# EasyEDA Pro project ProProject_基于CW32单片机的无刷电机控制器（旋转变压器位置反馈）_2024-06-02.epro, board PCB6
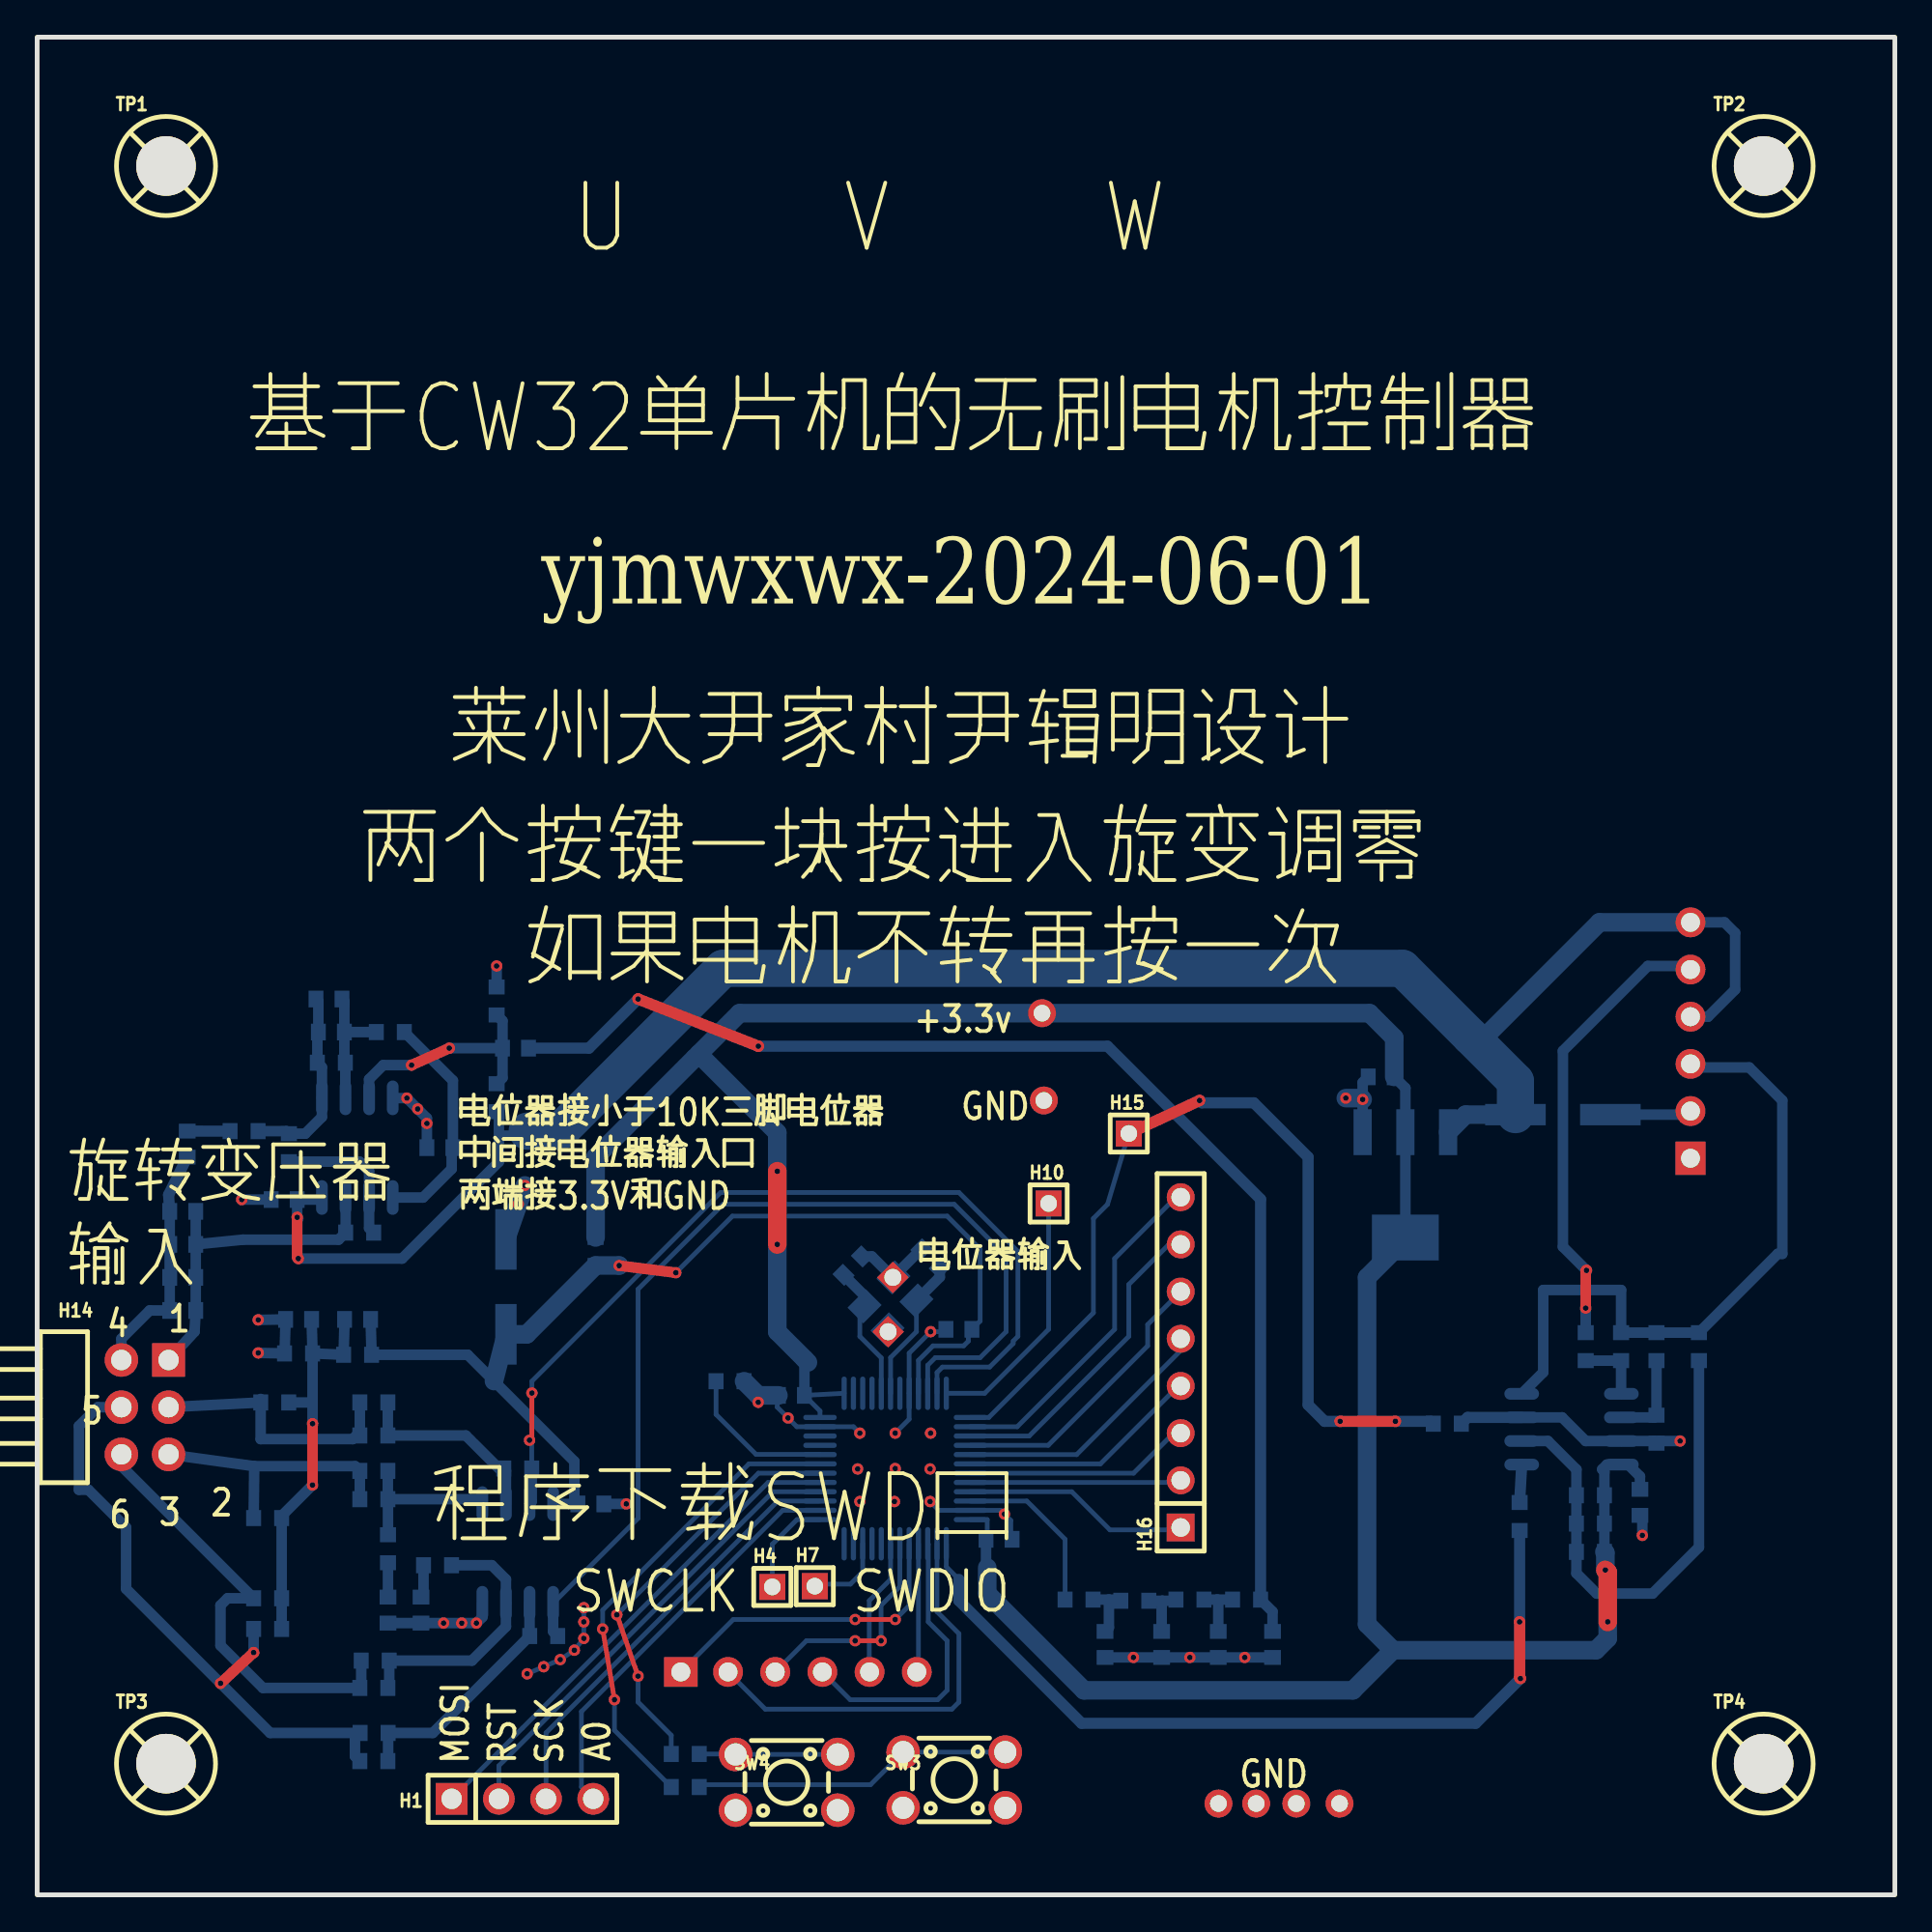
[diagram p4: board, top side]
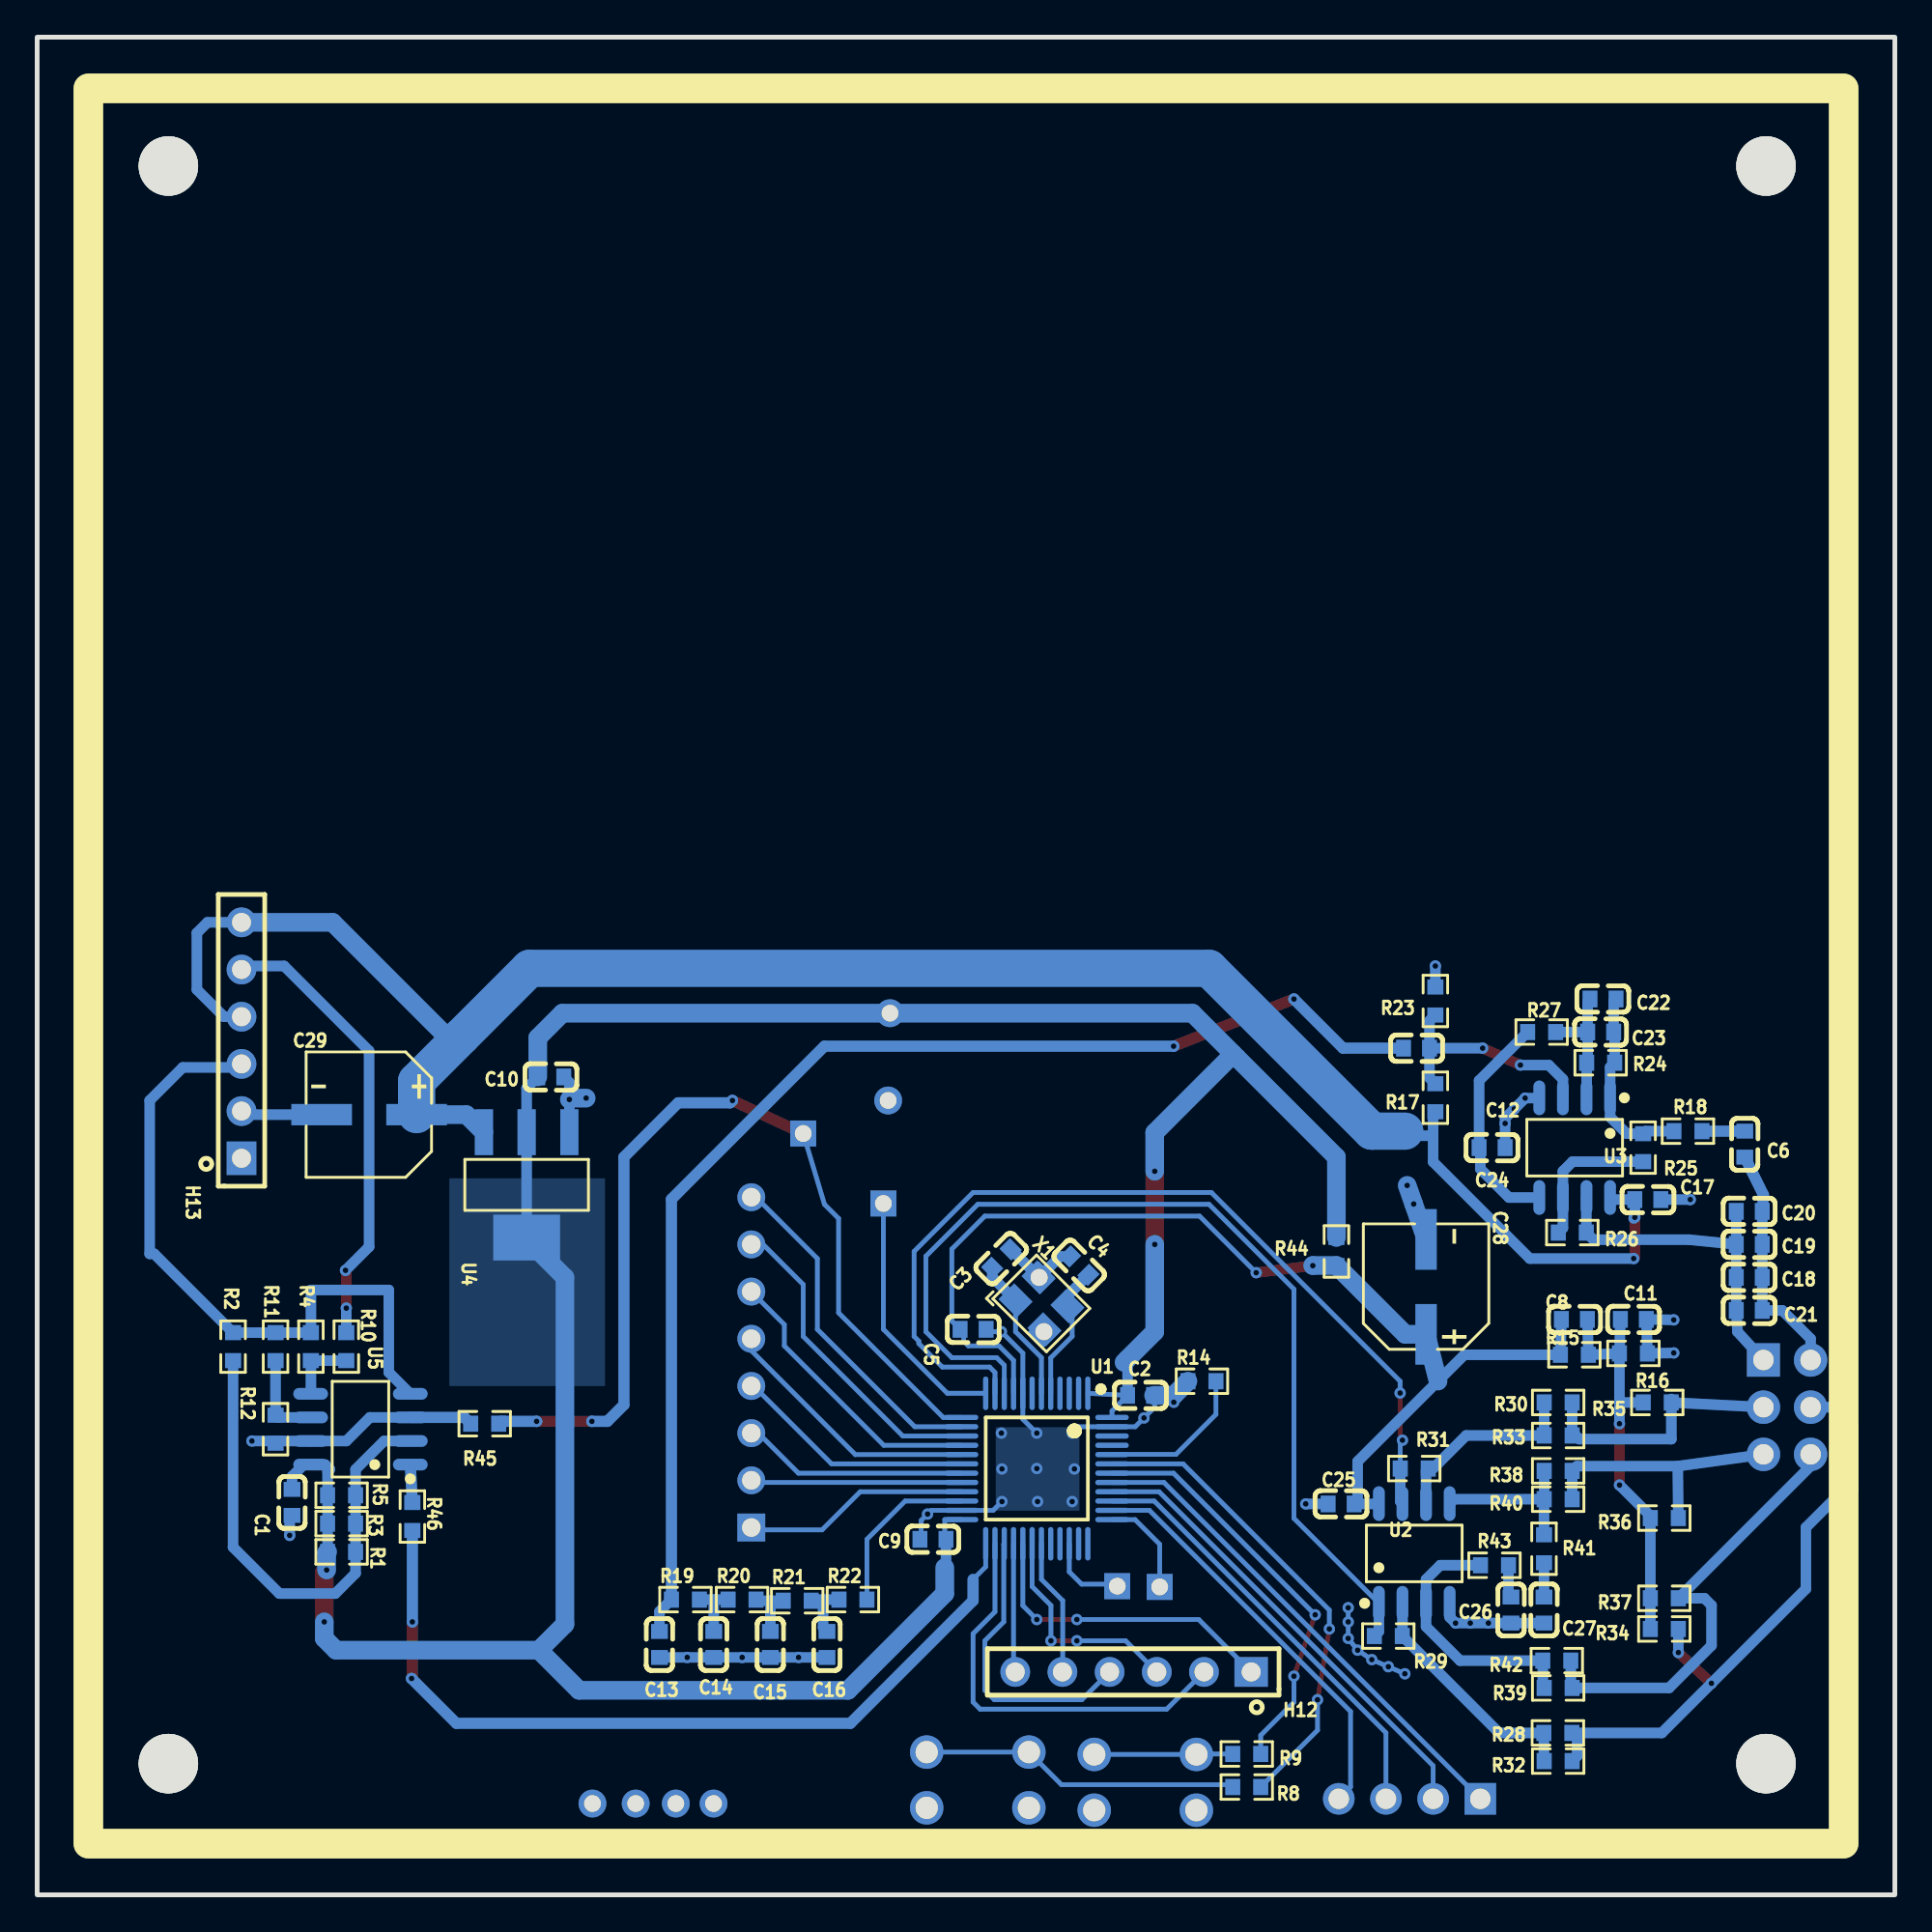
[diagram p5: board, bottom side, seen from below]

Outline 100 x 100 mm; copper layers: Top Layer, Bottom Layer. Coordinates in mm from the lower left corner of the outline.
Outline path: rectangle 0,100 100,0
Stack: Top Layer 0.035mm / Dielectric1 1.51mm FR4 er 4.5 / Bottom Layer 0.035mm

## Design rules (mm)
template: 自定义配置
spacing copperThickness1oz (default): track to track 0.102, other pairs 0.152 to 0.3
spacing copperThickness2oz: track to track 0.203, other pairs 0.152 to 0.3
track width copperThickness1oz (default): min 0.127, default 0.254, max 2.54
track width copperThickness2oz: min 0.203, default 0.254, max 2.54
differential pair differentialPair (default): width min 0.127, default 0.254, max 2.54; gap min 0.152, default 0.152
via viaSize (default): diameter min 0.5, default 0.61, max 10; hole min 0.3, default 0.305, max 6.3

## Placement (name value [footprint] x y rotation side)
C1  10uF  [C0603]  86.28 21.13 90 bottom
C2  10uF  [C0603]  40.6 26.89 180 bottom
C3  10pF  [C0603]  48.09 34.25 135 bottom
C4  10pF  [C0603]  43.9 33.87 225 bottom
C5  10uF  [C0603]  49.62 30.44 0 bottom
C6  100nF  [C0603]  8.08 40.41 90 bottom
C8  10uF  [C0603]  17.25 30.98 0 bottom
C9  10uF  [C0603]  51.78 19.14 180 bottom
C10  10uF  [C0603]  72.35 44.03 0 bottom
C11  10uF  [C0603]  14.07 30.98 0 bottom
C12  100nF  [C0603]  25.75 45.58 0 bottom
C13  100pF  [C0603]  66.5 13.48 90 bottom
C14  100pF  [C0603]  63.58 13.48 90 bottom
C15  100pF  [C0603]  60.53 13.48 90 bottom
C16  100pF  [C0603]  57.48 13.48 90 bottom
C17  10uF  [C0603]  13.3 37.43 0 bottom
C18  10nF  [C0603]  7.84 33.24 180 bottom
C19  10nF  [C0603]  7.84 35.01 180 bottom
C20  10nF  [C0603]  7.84 36.79 180 bottom
C21  10nF  [C0603]  7.84 31.46 180 bottom
C22  100pF  [C0603]  15.71 48.22 180 bottom
C23  100pF  [C0603]  15.84 46.44 180 bottom
C24  10uF  [C0603]  21.68 40.22 180 bottom
C25  10uF  [C0603]  29.81 21.04 180 bottom
C26  10uF  [C0603]  20.66 15.33 270 bottom
C27  10uF  [C0603]  18.89 15.33 270 bottom
C28  220uF  [CAP-SMD_BD6.3-L6.6-W6.6-LS7.2-R-RD]  25.23 32.73 270 bottom
C29  220uF  [CAP-SMD_BD6.3-L6.6-W6.6-LS7.2-R-RD]  82.13 42 180 bottom
H1  -  [HDR-TH_4P-P2.54-V-M]  26.12 5.17 0 top
H4  -  [HDR-TH_1P-V-M_XKB_X4611WV-01I-C28D40]  39.57 16.58 0 top
H7  -  [HDR-TH_1P-V-M_XKB_X4611WV-01I-C28D40]  41.86 16.62 0 top
H10  -  [HDR-TH_1P-V-M_XKB_X4611WV-01I-C28D40]  54.45 37.22 0 top
H12  PM254V-11-06-H85  [HDR-TH_6P-P2.54-V-F]  41 12 0 bottom
H13  PM254V-11-06-H85  [HDR-TH_6P-P2.54-V-F]  89 46 90 bottom
H14  PZ254R-12-6P  [HDR-TH_6P-P2.54-H-M-R2-C3-S2.54]  5.8 26.25 270 top
H15  -  [HDR-TH_1P-V-M_XKB_X4611WV-01I-C28D40]  58.76 40.98 0 top
H16  -  [HDR-TH_8P-P2.54-V-M]  61.56 28.66 90 top
NOREF  -  [Pad_e1511]  63.59 4.91 0 top
NOREF#2  -  [Pad_e524]  46.06 33.24 45 top
NOREF#3  -  [Pad_e1491]  54.09 47.46 0 top
NOREF#4  -  [Pad_e526]  45.81 30.31 45 top
NOREF#5  -  [Pad_e1495]  54.19 42.76 0 top
NOREF#6  -  [Pad_e1512]  65.62 4.91 0 top
NOREF#7  -  [Pad_e1513]  67.78 4.91 0 top
NOREF#8  -  [Pad_e1514]  70.11 4.91 0 top
R1  10kΩ  [R0603]  83.61 18.46 0 bottom
R2  10kΩ  [R0603]  89.45 29.51 270 bottom
R3  10kΩ  [R0603]  83.61 19.99 0 bottom
R4  100kΩ  [R0603]  85.26 29.51 270 bottom
R5  10kΩ  [R0603]  83.61 21.51 0 bottom
R8  10kΩ  [R0603]  34.89 5.8 0 bottom
R9  10kΩ  [R0603]  34.89 7.58 0 bottom
R10  10kΩ  [R0603]  83.36 29.51 270 bottom
R11  10kΩ  [R0603]  87.17 29.51 270 bottom
R12  100kΩ  [R0603]  87.17 25.07 270 bottom
R14  10kΩ  [R0603]  37.3 27.65 180 bottom
R15  1kΩ  [R0603]  17.25 29.07 0 bottom
R16  1kΩ  [R0603]  14.07 29.15 0 bottom
R17  1MΩ  [R0603]  24.73 42.91 270 bottom
R18  10Ω  [R0603]  11.14 41.11 0 bottom
R19  10kΩ  [R0603]  65.1 15.89 180 bottom
R20  10kΩ  [R0603]  62.06 15.89 180 bottom
R21  10kΩ  [R0603]  59.09 15.83 180 bottom
R22  10kΩ  [R0603]  56.09 15.89 180 bottom
R23  1MΩ  [R0603]  24.73 48.12 270 bottom
R24  100kΩ  [R0603]  15.84 44.79 0 bottom
R25  100kΩ  [R0603]  13.55 40.22 270 bottom
R26  100kΩ  [R0603]  17.36 35.65 180 bottom
R27  100kΩ  [R0603]  19.01 46.44 0 bottom
R28  100kΩ  [R0603]  18.14 8.72 0 bottom
R29  100kΩ  [R0603]  27.27 13.93 0 bottom
R30  100kΩ  [R0603]  18.12 26.5 0 bottom
R31  100kΩ  [R0603]  25.87 22.95 0 bottom
R32  100kΩ  [R0603]  18.12 7.2 0 bottom
R33  100kΩ  [R0603]  18.12 24.73 0 bottom
R34  100kΩ  [R0603]  12.41 14.31 180 bottom
R35  100kΩ  [R0603]  12.79 26.5 180 bottom
R36  100kΩ  [R0603]  12.41 20.28 0 bottom
R37  100kΩ  [R0603]  12.41 15.96 0 bottom
R38  100kΩ  [R0603]  18.12 22.82 0 bottom
R39  100kΩ  [R0603]  18.12 11.14 0 bottom
R40  100kΩ  [R0603]  18.12 21.3 0 bottom
R41  100kΩ  [R0603]  18.89 18.63 270 bottom
R42  100kΩ  [R0603]  18.2 12.61 0 bottom
R43  100kΩ  [R0603]  21.55 17.74 180 bottom
R44  10Ω  [R0603]  30.06 34.63 270 bottom
R45  1kΩ  [R0603]  75.91 25.36 0 bottom
R46  1kΩ  [R0603]  79.8 20.37 90 bottom
SW3  TC-1109-C-B  [KEY-TH_4P-L4.5-W4.5-P3.00-LS5.8]  49.37 6.19 180 top
SW4  TC-1109-C-B  [KEY-TH_4P-L4.5-W4.5-P3.00-LS5.8]  40.35 6.06 180 top
TP1  -  [M3螺丝]  7 93 0 top
TP2  -  [M3螺丝]  93 93 0 top
TP3  -  [M3螺丝]  7 7 0 top
TP4  -  [M3螺丝]  93 7 0 top
U1  CW32F030C8T6  [LQFP-48_L7.0-W7.0-P0.50-LS9.0-TL]  46.19 22.95 270 bottom
U2  -  [SOP-8_L4.9-W3.9-P1.27-LS6.0-BL]  25.87 18.38 180 bottom
U3  -  [SOP-8_L4.9-W3.9-P1.27-LS6.0-BL]  17.23 40.22 0 bottom
U4  AMS1117-3.3  [SOT-223-4_L6.5-W3.5-P2.30-LS7.0-BR]  73.65 38.22 90 bottom
U5  LMV358ARZ  [SOP-8_L4.9-W3.9-P1.27-LS6.0-BL]  82.6 25.07 90 bottom
X1  8MHz  [OSC-SMD_4P-L3.2-W2.5-BL]  45.94 31.84 225 bottom

## Footprints (pads in the part's own frame, mm; a bottom-side part is the same pattern mirrored in y, then rotated)
C0603
  rect 0.8x0.9 smd: 1(-0.7,0) 2(0.7,0)
CAP-SMD_BD6.3-L6.6-W6.6-LS7.2-R-RD
  rect 3.26x1.15 smd: 1(2.555,0) 2(-2.555,0)
HDR-TH_1P-V-M_XKB_X4611WV-01I-C28D40
  rect 1.4x1.4 hole 0.9: 1(0,0)
HDR-TH_4P-P2.54-V-M
  rect 1.7x1.7 hole 1.1: 1(-3.81,0)
  round 1.7 hole 1.1: 2(-1.27,0) 3(1.27,0) 4(3.81,0)
HDR-TH_6P-P2.54-H-M-R2-C3-S2.54
  rect 1.8x1.778 hole 1.1: 1(-2.54,1.27)
  round 1.8 hole 1.1: 2(0,1.27) 3(2.54,1.27) 4(-2.54,-1.27) 5(0,-1.27) 6(2.54,-1.27)
HDR-TH_6P-P2.54-V-F
  rect 1.8x1.6 hole 1.02: 1(-6.35,0)
  round 1.6 hole 1.02: 2(-3.81,0) 3(-1.27,0) 4(1.27,0) 5(3.81,0) 6(6.35,0)
HDR-TH_8P-P2.54-V-M
  rect 1.5x1.5 hole 1: 1(-8.89,0)
  round 1.5 hole 1: 2(-6.35,0) 3(-3.81,0) 4(-1.27,0) 5(1.27,0) 6(3.81,0) 7(6.35,0) 8(8.89,0)
KEY-TH_4P-L4.5-W4.5-P3.00-LS5.8
  round 1.8 hole 1.2: 1(-2.75,1.5) 2(2.75,1.5) 3(-2.75,-1.5) 4(2.75,-1.5)
LQFP-48_L7.0-W7.0-P0.50-LS9.0-TL
  oval 1.8x0.28 smd: 1(-4.05,2.75) 2(-4.05,2.25) 3(-4.05,1.75) 4(-4.05,1.25) 5(-4.05,0.75) 6(-4.05,0.25) 7(-4.05,-0.25) 8(-4.05,-0.75) 9(-4.05,-1.25) 10(-4.05,-1.75) 11(-4.05,-2.25) 12(-4.05,-2.75) 25(4.05,-2.75) 26(4.05,-2.25) 27(4.05,-1.75) 28(4.05,-1.25) 29(4.05,-0.75) 30(4.05,-0.25) 31(4.05,0.25) 32(4.05,0.75) 33(4.05,1.25) 34(4.05,1.75) 35(4.05,2.25) 36(4.05,2.75)
  oval 0.28x1.8 smd: 13(-2.75,-4.05) 14(-2.25,-4.05) 15(-1.75,-4.05) 16(-1.25,-4.05) 17(-0.75,-4.05) 18(-0.25,-4.05) 19(0.25,-4.05) 20(0.75,-4.05) 21(1.25,-4.05) 22(1.75,-4.05) 23(2.25,-4.05) 24(2.75,-4.05) 37(2.75,4.05) 38(2.25,4.05) 39(1.75,4.05) 40(1.25,4.05) 41(0.75,4.05) 42(0.25,4.05) 43(-0.25,4.05) 44(-0.75,4.05) 45(-1.25,4.05) 46(-1.75,4.05) 47(-2.25,4.05) 48(-2.75,4.05)
M3螺丝
  round 3.2 hole 3.2: 1(-0.064,0.064)
OSC-SMD_4P-L3.2-W2.5-BL
  rect 1.4x1.2 smd: 1(-1.1,-0.875) 2(1.1,-0.875) 3(1.1,0.875) 4(-1.1,0.875)
Pad_e524
  rect 1.2x1.2 hole 0.914: 1(0,0)
Pad_e526
  rect 1.2x1.2 hole 0.914: 1(0,0)
Pad_e1491
  round 1.5 hole 0.9: 1(0,0)
Pad_e1495
  round 1.5 hole 0.9: 2(0,0)
Pad_e1511
  round 1.5 hole 0.9: 3(0,0)
Pad_e1512
  round 1.5 hole 0.9: 4(0,0)
Pad_e1513
  round 1.5 hole 0.9: 9(0,0)
Pad_e1514
  round 1.5 hole 0.9: 49(0,0)
R0603
  rect 0.806x0.864 smd: 1(-0.753,0) 2(0.753,0)
SOP-8_L4.9-W3.9-P1.27-LS6.0-BL
  oval 0.63x1.865 smd: 1(-1.905,-2.683) 2(-0.635,-2.683) 3(0.635,-2.683) 4(1.905,-2.683) 5(1.905,2.683) 6(0.635,2.683) 7(-0.635,2.683) 8(-1.905,2.683)
SOT-223-4_L6.5-W3.5-P2.30-LS7.0-BR
  rect 2.47x0.98 smd: 1(2.835,-2.3) 2(2.835,0) 3(2.835,2.3)
  rect 2.47x3.6 smd: 4(-2.835,0)

## Nets
As in the schematic, except:
+3.3V: C1.2 C2.1 C9.2 C10.2 NOREF#3.1 R1.2 R3.2 R5.2 R44.1 U1.1 U1.24 U1.48 U4.2 U4.4 U5.8
GND: C1.1 C2.2 C3.2 C4.1 C5.1 C9.1 C10.1 C11.1 C13.1 C14.1 C15.1 C16.1 C17.1 C24.2 C25.1 C26.2 C27.2 C28.2 C29.2 H13.2 NOREF.3 NOREF#2.1 NOREF#4.1 NOREF#5.2 NOREF#6.4 NOREF#7.9 NOREF#8.49 R14.1 R16.1 R23.1 SW3.1 SW3.2 SW4.1 SW4.2 U1.8 U1.23 U1.47 U2.4 U3.4 U4.1 X1.2 X1.4
A: TP1.1 TP2.1
$5N2280: H14.5 R28.1 R32.1 R34.2
$5N2281: H14.6 R37.1 R39.1 R42.1
$5N2284: C18.1 C19.1 C20.1 C21.1 H14.1 R26.2 U3.7
$5N2285: C6.1 C18.2 C19.2 C20.2 C21.2 H14.4
$5N2815: H14.2 R30.1 R33.1 R35.2
$5N2828: H14.3 R36.1 R38.1 R40.1

Pads without a net: TP3 1; TP4 1; U1 7 45 46

## Via types
v1: diameter 0.61, hole 0.305, Top Layer to Bottom Layer, 73 vias

## Routing (per net, layer and track width the routed paths; a pad name or vN(x,y) marks a point on that pad's centre or on a via; arc(x,y) is an arc through that point)
+1.65V: length 22.2
  Top Layer w0.568: v1(14.83,25.36) 14.83,22.06 v1(14.82,22.06)
  Bottom Layer w0.568: C8.1 R15.1 R16.2 ; R16.2 14.83,26.56 ; R16.2 C11.2 ; R35.1 14.78,26.5 14.83,26.56 ; 14.83,26.56 v1(14.83,25.36) ; R34.1 R37.2 R36.2 13.16,20.4 v1(14.82,22.06)
+3.3V: length 164.7
  Top Layer w1: v1(39.84,35.01) v1(39.84,38.95) ; v1(84.54,14.69) 84.54,17.36 v1(84.42,17.49)
  Bottom Layer w0.254: U1.1 C2.1 42.14,26.05 U1.48 ; C9.2 51.14,19.2 51.14,20.2 U1.24
  Bottom Layer w0.568: R1.2 R3.2 R5.2 84.37,22.79 84.25,22.91 84.5,23.16 U5.8 85.64,23.16 86.28,22.53 C1.2 ; C2.1 41.3,28.85 ; 51.14,17.62 51.08,17.68 C9.2 ; C10.2 73.65,43.43 U4.2 U4.4
  Bottom Layer w1: 72.99,13.17 70.83,11.01 56.35,11.01 51.14,16.22 51.14,17.62 ; 72.99,13.17 83.91,13.17 84.54,13.81 v1(84.54,14.69) ; 72.99,13.17 71.59,14.57 71.59,33.24 73.88,35.52 ; R44.1 30.06,39.71 35.42,45.07 35.8,45.07 ; v1(39.84,38.95) 39.84,41.03 35.8,45.07 ; 41.49,28.66 39.84,30.31 v1(39.84,35.01) ; v1(84.42,17.49) 84.42,18.41 R1.2 ; 35.8,45.07 35.61,45.26 37.81,47.46 NOREF#3.1 71.73,47.46 73.05,46.13 C10.2
+3.3VA: length 60.7
  Top Layer w0.568: v1(34.38,33.49) v1(31.33,33.87)
  Bottom Layer w0.254: v1(34.38,33.49) 37.43,36.54 48.98,36.54 50.76,34.76 50.76,30.88 C5.2 50.13,30.25 50.13,29.81 49.87,29.55 48.22,29.55 47.44,28.77 U1.9
  Bottom Layer w0.568: C8.2 R15.2 23.18,29.07 28.92,23.33 28.92,21.23 C25.2 27.79,21.04 U2.8
  Bottom Layer w1: 24.59,27.66 C28.1 26.35,30.17 R44.2 31.32,33.88 v1(31.33,33.87)
+5V: length 110.2
  Top Layer w0.568: v1(14.06,34.25) 14,34.31 v1(14,36.47)
  Bottom Layer w0.568: H13.6 90.83,52.35 91.4,51.78 91.4,48.73 89.94,47.27 H13.4 ; 14.06,36.41 v1(14,36.47) C17.2 15.22,37.43 U3.8 ; 24.85,40.86 24.85,42.04 R17.2 ; 24.85,40.86 26.13,40.86 26.38,41.11 ; 24.85,40.86 24.85,39.46 19.65,34.25 v1(14.06,34.25)
  Bottom Layer w1: H13.6 84.1,52.35 77.97,46.22 77.15,46.22 ; C29.1 76.9,42 U4.3
  Bottom Layer w2: C29.1 79.58,43.79 73.5,49.87 36.92,49.87 28.16,41.11 26.38,41.11
GND: length 70.5
  Bottom Layer w0.254: v1(29.43,15.46) v1(29.43,14.69) v1(29.43,13.81) v1(28.92,13.17) v1(28.16,12.66) v1(27.27,12.28) v1(26.38,11.9) ; v1(46.19,24.85) 46.94,25.6 U1.8 46.94,29.16 v1(48.09,30.31) 48.79,30.31 C5.1 ; v1(48.07,21.17) 48.54,20.7 U1.23 51.87,20.7 52.41,20.16 52.41,19.2 C9.1 ; C2.2 39.84,26.82 39.84,26.25 v1(40.42,25.67) 40.89,25.2 U1.47 43.94,25.2 v1(44.28,24.85)
  Bottom Layer w0.568: v1(11.9,30.95) C11.1 R16.1 v1(11.9,29.17) ; C29.2 88.81,42 H13.2 ; U2.4 23.97,14.95 v1(23.65,14.63) v1(22.85,14.63) v1(21.88,14.63) 18.89,14.63 ; U3.4 19.15,42.89 v1(19.9,42.89) v1(20.48,42.3) 20.98,41.81 C24.2 ; 44.4,34.37 44.93,34.37 NOREF#2.1 47.57,34.75 47.6,34.75 ; U4.1 v1(71.35,42.82) 71.35,43.73 C10.1 ; 30.51,21.04 v1(31.71,21.04) ; v1(86.41,19.35) 86.41,20.3 C1.1 ; 24.73,48.87 v1(24.73,50) ; C17.1 v1(11.01,37.43) ; C13.1 v1(65.01,12.78) C14.1 v1(62.05,12.78) C15.1 v1(59.01,12.78) C16.1
  Bottom Layer w1: R14.1 38.82,26.89 C2.2 ; v1(71.35,42.82) 71.28,42.89 v1(70.45,42.89) ; v1(26.25,38.19) v1(25.9,37.19) C28.2
  vias: v1(20.98,41.53) v1(38.82,26.52) v1(44.17,22.93) v1(44.28,21.17) v1(46.15,21.17) v1(46.19,22.95) v1(48.09,24.85) v1(48.07,22.93) v1(52.07,20.5)
GND_BT-: length 37
  Bottom Layer w0.568: U5.4 81.07,28.13 81.07,32.56 85.26,32.56 R4.1 R11.1 R2.1 93.7,34.51 93.94,34.51 93.94,42.76 92.16,44.54 89.19,44.54 H13.3
PA0_ADC: length 54.1
  Bottom Layer w0.254: U2.1 32.35,20.27 32.35,32.6 36.92,37.17 49.37,37.17 52.16,34.38 52.16,30.31 50.76,28.92 48.35,28.92 47.94,28.51 U1.10
  Bottom Layer w0.568: R29.2 27.78,14.18 U2.1
PA1_ADC1: length 49.4
  Top Layer w0.254: v1(26.63,27.01) 26.63,24.6 v1(26.5,24.47)
  Bottom Layer w0.254: v1(26.63,27.01) 26.63,27.65 36.79,37.81 49.62,37.81 52.79,34.63 52.79,30.06 52.54,29.81 52.54,29.68 51.27,28.41 48.73,28.41 48.44,28.12 U1.11 ; R31.2 26.62,24.35 v1(26.5,24.47)
  Bottom Layer w0.568: 26.5,21.06 26.62,21.18 R31.2
PA2_ADC2: length 13.7
  Bottom Layer w0.254: U1.12 51,27 54.45,30.44 H10.1
PA3_ADC3: length 50.9
  Top Layer w0.6: H15.1 v1(62.57,42.76) ; v1(70.14,25.49) v1(73.11,25.49)
  Bottom Layer w0.254: U1.13 51.23,25.7 56.86,31.33 56.86,36.41 57.62,37.17 H15.1
  Bottom Layer w0.6: R45.1 75.03,25.49 v1(73.11,25.49) ; v1(70.14,25.49) 69.3,25.49 68.41,26.38 68.41,39.71 65.49,42.63 62.7,42.63 v1(62.57,42.76)
PA8_ATIM_CH1A_U_H: length 17.1
  Top Layer w0.254: v1(46.19,14.82) v1(44.03,14.82)
  Bottom Layer w0.254: v1(46.19,14.82) 46.94,15.57 U1.29 ; H12.1 37.47,14.82 v1(44.03,14.82)
PA9_ATIM_CH2A_V_H: length 12
  Top Layer w0.254: v1(45.43,13.68) v1(44.03,13.68)
  Bottom Layer w0.254: H12.3 41.41,13.68 v1(44.03,13.68) ; v1(45.43,13.68) 45.43,15.58 46.44,16.59 U1.30
PA10_ATIM_CH3A_W_H: length 7.4
  Bottom Layer w0.254: U1.31 45.94,16.98 44.79,15.84 44.79,12.02 H12.5
PA13_SWDIO: length 4.4
  Bottom Layer w0.254: U1.34 44.44,17.39 43.78,16.73 41.97,16.73 H7.1
PA14_SWCLK: length 5.4
  Bottom Layer w0.254: U1.37 40.9,20.2 39.57,18.87 H4.1
PA15_SPI1_CS_LCD_A0: length 22.3
  Bottom Layer w0.254: U1.38 40.13,20.7 29.3,9.87 29.3,5.8 H1.4
PB3_SPI1_SCK: length 23.5
  Bottom Layer w0.254: U1.39 39.87,21.2 27.39,8.72 H1.3
PB4_LCD_RST: length 25.2
  Bottom Layer w0.254: H1.2 24.85,6.95 39.61,21.7 U1.40
PB5_SPI1_MOSI: length 26.9
  Bottom Layer w0.254: U1.41 39.34,22.2 H1.1
PB11_GTIM2_CH4: length 9.2
  Bottom Layer w0.254: U1.22 53.27,21.2 55.33,19.14 55.33,15.89
PB12_ATIM_BK: length 45.3
  Top Layer w0.6: v1(79.84,11.65) 79.8,11.69 v1(79.8,14.69)
  Bottom Layer w0.254: U1.25 48.94,17.66 49.62,16.98
  Bottom Layer w0.6: 49.62,16.98 49.62,15.84 56.22,9.23 77.43,9.23 v1(79.84,11.65) ; 79.8,19.61 v1(79.8,14.69)
PB13_ATIM_CH1B_U_L: length 22.4
  Bottom Layer w0.254: H12.2 39.19,10 49.24,10 49.62,10.38 49.62,14.06 48.44,15.24 U1.26
PB14_ATIM_CH2B_V_L: length 15.9
  Bottom Layer w0.254: U1.27 47.97,18.87 47.97,14.69 48.98,13.68 48.98,11.01 48.48,10.5 43.77,10.5 H12.4
PB15_ATIM_CH3B_W_L: length 6.9
  Bottom Layer w0.254: H12.6 47.44,12.09 U1.28
$3N1046: length 7.4
  Bottom Layer w0.254: X1.3 44.28,31.43 44.28,30.06 45.44,28.91 U1.5
  Bottom Layer w0.568: 43.41,33.38 44.54,32.25 X1.3
$3N1253: length 7.9
  Bottom Layer w0.254: U1.6 45.94,28.92 47.33,30.31 X1.1
  Bottom Layer w0.568: X1.1 48.59,33.26 48.59,33.76
$3N1416: length 8.3
  Bottom Layer w0.254: R14.2 36.55,25.86 38.7,23.71 42.13,23.71 U1.44
$3N1882: length 25.8
  Top Layer w0.254: v1(31.08,10.5) v1(30.44,14.31)
  Bottom Layer w0.254: R8.1 31.08,8.86 v1(31.08,10.5) ; v1(30.44,14.31) 30.44,15.33 38.31,23.2 U1.43
$3N1886: length 22.5
  Top Layer w0.254: v1(32.35,11.77) v1(31.2,15.07)
  Bottom Layer w0.254: v1(32.35,11.77) 32.35,10.38 34.13,8.59 R9.1 ; v1(31.2,15.07) 38.83,22.7 U1.42
$3N6202: length 12.2
  Bottom Layer w0.254: H16.1 61.43,19.65 57.75,19.65 55.69,21.7 U1.21
$3N6205: length 11.4
  Bottom Layer w0.254: U1.20 61.44,22.2 H16.2
$3N6208: length 12.2
  Bottom Layer w0.254: U1.19 59.02,22.7 61.18,24.85 H16.3
$3N6214: length 13.1
  Bottom Layer w0.254: U1.18 57.24,23.2 61.43,27.39 H16.4
$3N6221: length 14.3
  Bottom Layer w0.254: H16.5 61.56,29.3 55.96,23.7 U1.17
$3N6224: length 15.4
  Bottom Layer w0.254: U1.16 54.43,24.2 59.78,29.55 59.78,30.7 H16.6
$3N6227: length 17.2
  Bottom Layer w0.254: H16.7 60.92,35.01 58.76,32.86 58.76,30.06 53.4,24.7 U1.15
$3N6233: length 18.7
  Bottom Layer w0.254: U1.14 52.76,25.2 58,30.44 58,34.25 61.3,37.55 H16.8
$3N9618: length 17.3
  Bottom Layer w0.254: SW3.3 SW3.4 44.86,5.93 35.77,5.93 R8.2
$3N9625: length 7.5
  Bottom Layer w0.254: R9.2 37.57,7.58 SW4.4 SW4.3
$3N13394: length 3.7
  Bottom Layer w0.568: U5.5 85.26,26.99 85.26,28.76 83.36,28.76
$3N13395: length 4.9
  Bottom Layer w0.568: U5.6 87.05,25.7 R12.1 87.17,28.76
$3N13400: length 27.3
  Bottom Layer w0.568: 89.45,28.76 89.45,18.72 86.96,16.22 83.95,16.22 82.86,17.31 R1.1 R3.1 R5.1 82.86,22.9 81.33,24.43 U5.2
$3N13416: length 2
  Bottom Layer w0.6: R46.2 U5.1
$3N18094: length 24.5
  Top Layer w0.568: v1(83.4,33.62) 83.36,33.57 v1(83.36,31.59)
  Bottom Layer w0.568: R10.1 v1(83.36,31.59) ; v1(83.4,33.62) 82.13,34.89 82.13,45.43 86.7,50 88.81,50 H13.5
$3N21169: length 12.5
  Bottom Layer w0.568: U5.3 82.09,25.7 83.36,24.43 U5.7 87.05,24.43 R12.2 87.29,24.43 v1(88.44,24.43)
  Bottom Layer w0.6: U5.3 77,25.7 R45.2
$5N2241: length 3.3
  Bottom Layer w0.568: C14.2 63.58,15.84 63.52,15.89 ; 63.52,15.89 R19.2 ; 63.52,15.89 R20.1
$5N2242: length 3.2
  Bottom Layer w0.568: C15.2 60.53,15.8 60.57,15.83 ; 60.57,15.83 61.24,15.83 R20.2 ; 60.57,15.83 R21.1
$5N2243: length 3.3
  Bottom Layer w0.568: 57.69,15.89 58.27,15.89 R21.2 ; 57.69,15.89 57.69,14.39 C16.2 ; 57.69,15.89 R22.1
$5N2244: length 67.9
  Top Layer w0.6: v1(38.82,45.68) v1(32.35,48.22)
  Bottom Layer w0.568: C13.2 66.5,15.25 R19.1
  Bottom Layer w0.6: v1(38.82,45.68) 57.62,45.68 65.86,37.44 R19.1 ; v1(32.35,48.22) 29.7,45.58 C12.2
$5N2255: length 12.7
  Top Layer w0.568: v1(20.16,44.67) v1(22.19,45.58)
  Bottom Layer w0.568: R23.2 25.05,47.05 C12.1 ; v1(20.16,44.67) 18.63,44.67 17.87,43.9 U3.3 ; R17.1 25.05,43.98 C12.1 ; C12.1 v1(22.19,45.58)
$5N2259: length 7.9
  Bottom Layer w0.568: R26.1 17.87,35.89 U3.6 17.87,38.95 17.35,39.47 R25.2
$5N2266: length 13.1
  Bottom Layer w0.568: R32.2 18.89,7.22 R28.2 21.3,8.72 R29.1 26.5,13.94 26.5,15.69
$5N2267: length 14.3
  Bottom Layer w0.568: R43.1 24.47,17.74 25.23,16.98 U2.3 25.23,14.44 23.4,12.61 R42.2 18.95,11.21 R39.2
$5N2269: length 1.8
  Bottom Layer w0.568: R43.2 20.8,16.16 C26.1
$5N2271: length 1.8
  Bottom Layer w0.568: C27.1 R41.2
$5N2272: length 10.4
  Bottom Layer w0.568: 24.85,22.95 23.08,24.73 R33.2 R30.2 ; R31.1 25.23,22.83 U2.6
$5N2273: length 8.6
  Bottom Layer w0.568: R41.1 18.89,21.29 R40.2 ; U2.5 23.73,21.3 R40.2 ; R40.2 R38.2
$5N2280: length 34
  Top Layer w0.568: v1(9.87,11.39) v1(11.65,13.04)
  Bottom Layer w0.568: H14.5 3.26,26.25 2.25,25.24 2.25,21.81 2.76,21.81 4.79,19.77 4.79,16.47 v1(9.87,11.39) 12.54,8.72 17.11,8.72 ; 17.11,8.72 17.11,7.46 R32.1 ; 17.11,8.72 R28.1 ; R34.2 v1(11.65,13.04)
$5N2281: length 24.7
  Bottom Layer w0.568: H14.6 4.53,23.08 R37.1 10.25,15.96 9.87,15.58 9.87,13.42 12.15,11.14 R39.1 17.44,11.21 R42.1
$5N2284: length 18.7
  Bottom Layer w0.568: C19.1 C18.1 C21.1 8.47,30.31 H14.1 ; C19.1 11.08,35.27 16.23,35.27 R26.2 16.61,37.53 16.6,37.54 ; C19.1 C20.1
$5N2285: length 12.9
  Bottom Layer w0.568: H14.4 4.53,29.93 6.06,31.46 C21.2 C18.2 C19.2 C20.2
  Bottom Layer w0.6: C20.2 7.07,37.68 C6.1
$5N2815: length 14.4
  Bottom Layer w0.568: 12.03,26.69 12.03,26.5 ; 12.03,26.5 12.03,24.53 16.98,24.53 17.36,24.91 ; 12.03,26.5 H14.2 ; 12.03,26.5 R35.2 ; R30.1 R33.1
$5N2828: length 14.8
  Bottom Layer w0.568: R40.1 R38.1 17.12,23.08 11.69,23.08 ; 11.69,23.08 H14.3 ; 11.69,23.08 R36.1
$5N2844: length 12.3
  Bottom Layer w0.568: R27.2 22.38,43.83 C24.1 22.31,40.16 22.31,39.08 20.77,37.54 U3.5
$5N5792: length 10.4
  Bottom Layer w0.568: R18.2 13.42,41.11 R25.1 14.43,40.97 15.33,41.87 U3.1 15.33,44.55 R24.1 15.08,46.39 C23.2 15.14,48.09 C22.2
$5N5806: length 7.1
  Bottom Layer w0.568: C23.1 R27.1 ; C23.1 16.54,48.09 C22.1 ; C23.1 16.54,44.85 R24.2 16.59,42.91 16.6,42.9
$5N5964: length 2.3
  Bottom Layer w0.6: C6.2 R18.1

## Copper pours and planes (outline as drawn; the poured copper is in the pictures)
+3.3V on Bottom Layer: 69.43,38.57 77.81,38.57 77.81,27.39 69.43,27.39
GND on Top Layer: 0.6,53.94 98.9,53.94 98.9,0.72 0.6,0.72
GND on Bottom Layer: 43.9,25.18 48.4,25.18 48.4,20.68 43.9,20.68
A on Top Layer: 0,100 100,100 100,55.91 0,55.91

## Text on the board
Top Silkscreen Layer: 5 | 4 | 6 | 3 | 1 | 2 | +3.3v | GND | MOSI | RST | SCK | A0 | SWCLK | SWDIO | U     V     W | 电位器接小于10K三脚电位器 / 中间接电位器输入口 / 两端接3.3V和GND | 电位器输入 | 旋转变压器 / 输入 | 基于CW32单片机的无刷电机控制器 | 两个按键一块按进入旋变调零 | 程序下载SWD口 | 莱州大尹家村尹辑明设计 | 如果电机不转再按一次 | yjmwxwx-2024-06-01
